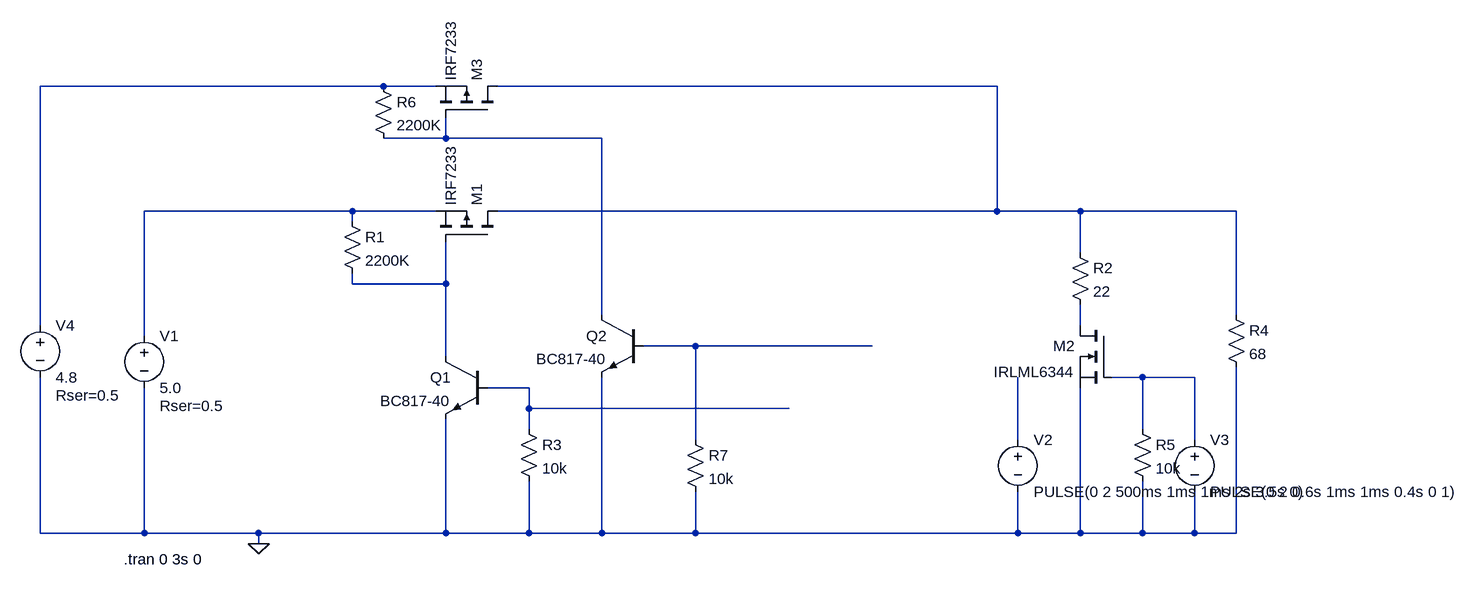
[diagram p0: schematic power switch 2.asc]
power switch 2.asc, the LTspice schematic file:
Version 4
SHEET 1 1800 680
WIRE 128 -128 -400 -128
WIRE 208 -128 128 -128
WIRE 1072 -128 304 -128
WIRE 224 -48 224 -80
WIRE 224 -48 128 -48
WIRE 464 -48 224 -48
WIRE 80 64 -240 64
WIRE 208 64 80 64
WIRE 1072 64 1072 -128
WIRE 1072 64 304 64
WIRE 1200 64 1072 64
WIRE 1440 64 1200 64
WIRE 80 80 80 64
WIRE 1200 128 1200 64
WIRE 80 176 80 160
WIRE 224 176 224 112
WIRE 224 176 80 176
WIRE 464 224 464 -48
WIRE 1440 224 1440 64
WIRE -400 240 -400 -128
WIRE 1200 240 1200 208
WIRE -240 256 -240 64
WIRE 608 272 528 272
WIRE 880 272 608 272
WIRE 224 288 224 176
WIRE 1296 320 1248 320
WIRE 1376 320 1296 320
WIRE 352 336 288 336
WIRE 352 368 352 336
WIRE 752 368 352 368
WIRE 352 400 352 368
WIRE 1296 400 1296 320
WIRE 608 416 608 272
WIRE 1104 416 1104 320
WIRE 1376 416 1376 320
WIRE -400 560 -400 320
WIRE -240 560 -240 336
WIRE -240 560 -400 560
WIRE -64 560 -240 560
WIRE 224 560 224 384
WIRE 224 560 -64 560
WIRE 352 560 352 480
WIRE 352 560 224 560
WIRE 464 560 464 320
WIRE 464 560 352 560
WIRE 608 560 608 496
WIRE 608 560 464 560
WIRE 1104 560 1104 496
WIRE 1104 560 608 560
WIRE 1200 560 1200 336
WIRE 1200 560 1104 560
WIRE 1296 560 1296 480
WIRE 1296 560 1200 560
WIRE 1376 560 1376 496
WIRE 1376 560 1296 560
WIRE 1440 560 1440 304
WIRE 1440 560 1376 560
WIRE -64 576 -64 560
FLAG -64 576 0
SYMBOL pmos 304 112 M270
SYMATTR InstName M1
SYMATTR Value IRF7233
SYMBOL res 64 64 R0
SYMATTR InstName R1
SYMATTR Value 2200K
SYMBOL voltage -240 240 R0
WINDOW 123 0 0 Left 0
WINDOW 39 24 124 Left 2
SYMATTR SpiceLine Rser=0.5
SYMATTR InstName V1
SYMATTR Value 5.0
SYMBOL npn 288 288 M0
SYMATTR InstName Q1
SYMATTR Value BC817-40
SYMBOL nmos 1248 240 M0
SYMATTR InstName M2
SYMATTR Value IRLML6344
SYMBOL res 1184 112 R0
SYMATTR InstName R2
SYMATTR Value 22
SYMBOL res 336 384 R0
SYMATTR InstName R3
SYMATTR Value 10k
SYMBOL res 1424 208 R0
SYMATTR InstName R4
SYMATTR Value 68
SYMBOL voltage 1104 400 R0
WINDOW 123 0 0 Left 0
WINDOW 39 0 0 Left 0
SYMATTR InstName V2
SYMATTR Value PULSE(0 2 500ms 1ms 1ms 2s 3.5s 0)
SYMBOL voltage 1376 400 R0
WINDOW 123 0 0 Left 0
WINDOW 39 0 0 Left 0
SYMATTR InstName V3
SYMATTR Value PULSE(0 2 0.6s 1ms 1ms 0.4s 0 1)
SYMBOL res 1280 384 R0
SYMATTR InstName R5
SYMATTR Value 10k
SYMBOL voltage -400 224 R0
WINDOW 123 0 0 Left 0
WINDOW 39 24 124 Left 2
SYMATTR SpiceLine Rser=0.5
SYMATTR InstName V4
SYMATTR Value 4.8
SYMBOL pmos 304 -80 M270
SYMATTR InstName M3
SYMATTR Value IRF7233
SYMBOL res 112 -144 R0
SYMATTR InstName R6
SYMATTR Value 2200K
SYMBOL npn 528 224 M0
SYMATTR InstName Q2
SYMATTR Value BC817-40
SYMBOL res 592 400 R0
SYMATTR InstName R7
SYMATTR Value 10k
TEXT -272 600 Left 2 !.tran 0 3s 0

The netlist it stands for:
* power switch 2.asc
M1 N002 N005 N004 N004 IRF7233
R1 N004 N005 2200K
V1 N004 0 5.0 Rser=0.5
Q1 N005 N009 0 0 BC817-40
M2 N006 N008 0 0 IRLML6344
R2 N002 N006 22
R3 N009 0 10k
R4 N002 0 68
V2 N010 0 PULSE(0 2 500ms 1ms 1ms 2s 3.5s 0)
V3 N008 0 PULSE(0 2 0.6s 1ms 1ms 0.4s 0 1)
R5 N008 0 10k
V4 N001 0 4.8 Rser=0.5
M3 N002 N003 N001 N001 IRF7233
R6 N001 N003 2200K
Q2 N003 N007 0 0 BC817-40
R7 N007 0 10k
.model NPN NPN
.model PNP PNP
.lib standard.bjt
.model NMOS NMOS
.model PMOS PMOS
.lib standard.mos
.tran 0 3s 0
.backanno
.end